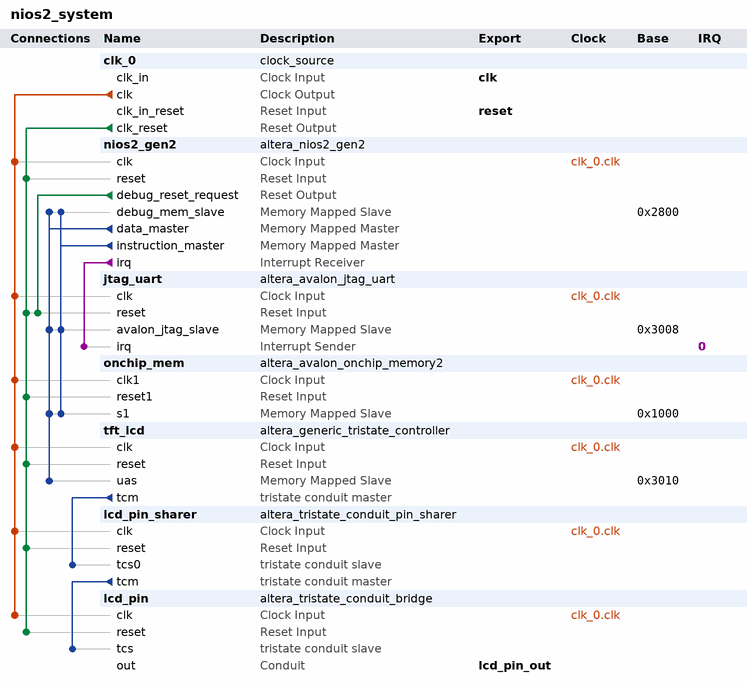
[diagram p0: system contents]
# Platform Designer (Qsys) system nios2_system, Cyclone V 5CSEBA6U23I7
# Parameters at their usual value, and those the tool derives, are not listed.
package require -exact qsys 18.1
create_system nios2_system
set_project_property DEVICE_FAMILY {Cyclone V}
set_project_property DEVICE 5CSEBA6U23I7

add_instance clk_0 clock_source 18.1
set_instance_parameter_value clk_0 clockFrequency 50000000

add_instance nios2_gen2 altera_nios2_gen2 18.1
set_instance_parameter_value nios2_gen2 dcache_size 2048
set_instance_parameter_value nios2_gen2 exceptionSlave onchip_mem.s1
set_instance_parameter_value nios2_gen2 icache_size 4096
set_instance_parameter_value nios2_gen2 impl Tiny
set_instance_parameter_value nios2_gen2 resetSlave onchip_mem.s1

add_instance jtag_uart altera_avalon_jtag_uart 18.1
set_instance_parameter_value jtag_uart simInteractiveOptions NO_INTERACTIVE_WINDOWS

add_instance onchip_mem altera_avalon_onchip_memory2 18.1
set_instance_parameter_value onchip_mem dataWidth 32
set_instance_parameter_value onchip_mem dualPort false
set_instance_parameter_value onchip_mem initMemContent true
set_instance_parameter_value onchip_mem initializationFileName onchip_mem.hex
set_instance_parameter_value onchip_mem memorySize 4096

add_instance tft_lcd altera_generic_tristate_controller 18.1
set_instance_parameter_value tft_lcd ACTIVE_LOW_BEGINTRANSFER 0
set_instance_parameter_value tft_lcd ACTIVE_LOW_BYTEENABLE 0
set_instance_parameter_value tft_lcd ACTIVE_LOW_OUTPUTENABLE 0
set_instance_parameter_value tft_lcd ACTIVE_LOW_READ 1
set_instance_parameter_value tft_lcd ACTIVE_LOW_RESET_OUTPUT 1
set_instance_parameter_value tft_lcd CHIPSELECT_THROUGH_READLATENCY 1
set_instance_parameter_value tft_lcd IS_MEMORY_DEVICE 0
set_instance_parameter_value tft_lcd TCM_ADDRESS_W 1
set_instance_parameter_value tft_lcd TCM_BYTEENABLE_W 1
set_instance_parameter_value tft_lcd TCM_DATA_HOLD 20
set_instance_parameter_value tft_lcd TCM_DATA_W 8
set_instance_parameter_value tft_lcd TCM_MAX_PENDING_READ_TRANSACTIONS 1
set_instance_parameter_value tft_lcd TCM_READLATENCY 2
set_instance_parameter_value tft_lcd TCM_READ_WAIT 80
set_instance_parameter_value tft_lcd TCM_SETUP_WAIT 0
set_instance_parameter_value tft_lcd TCM_SYMBOLS_PER_WORD 1
set_instance_parameter_value tft_lcd TCM_TIMING_UNITS 0
set_instance_parameter_value tft_lcd TCM_TURNAROUND_TIME 1
set_instance_parameter_value tft_lcd TCM_WRITE_WAIT 20
set_instance_parameter_value tft_lcd USE_BEGINTRANSFER 0
set_instance_parameter_value tft_lcd USE_BYTEENABLE 0
set_instance_parameter_value tft_lcd USE_OUTPUTENABLE 0
set_instance_parameter_value tft_lcd USE_READ 1
set_instance_parameter_value tft_lcd USE_RESET_OUTPUT 1

add_instance lcd_pin_sharer altera_tristate_conduit_pin_sharer 18.1
set_instance_parameter_value lcd_pin_sharer MODULE_ORIGIN_LIST tft_lcd.tcm,tft_lcd.tcm,tft_lcd.tcm,tft_lcd.tcm,tft_lcd.tcm,tft_lcd.tcm
set_instance_parameter_value lcd_pin_sharer NUM_INTERFACES 1
set_instance_parameter_value lcd_pin_sharer SHARED_SIGNAL_LIST LCD_RS,LCD_RD_n,LCD_REST_n,LCD_WR_n,LCD_DATA,LCD_CS_n
set_instance_parameter_value lcd_pin_sharer SIGNAL_ORIGIN_LIST address,read_n,reset_n,write_n,data,chipselect_n

add_instance lcd_pin altera_tristate_conduit_bridge 18.1

# connections
add_connection clk_0.clk jtag_uart.clk clock
add_connection clk_0.clk lcd_pin.clk clock
add_connection clk_0.clk lcd_pin_sharer.clk clock
add_connection clk_0.clk nios2_gen2.clk clock
add_connection clk_0.clk onchip_mem.clk1 clock
add_connection clk_0.clk tft_lcd.clk clock
add_connection clk_0.clk_reset jtag_uart.reset reset
add_connection clk_0.clk_reset lcd_pin.reset reset
add_connection clk_0.clk_reset lcd_pin_sharer.reset reset
add_connection clk_0.clk_reset nios2_gen2.reset reset
add_connection clk_0.clk_reset onchip_mem.reset1 reset
add_connection clk_0.clk_reset tft_lcd.reset reset
add_connection nios2_gen2.debug_reset_request jtag_uart.reset reset
add_connection nios2_gen2.data_master jtag_uart.avalon_jtag_slave avalon
set_connection_parameter_value nios2_gen2.data_master/jtag_uart.avalon_jtag_slave baseAddress 0x3008
add_connection nios2_gen2.data_master nios2_gen2.debug_mem_slave avalon
set_connection_parameter_value nios2_gen2.data_master/nios2_gen2.debug_mem_slave baseAddress 0x2800
add_connection nios2_gen2.data_master onchip_mem.s1 avalon
set_connection_parameter_value nios2_gen2.data_master/onchip_mem.s1 baseAddress 0x1000
add_connection nios2_gen2.data_master tft_lcd.uas avalon
set_connection_parameter_value nios2_gen2.data_master/tft_lcd.uas baseAddress 0x3010
add_connection nios2_gen2.instruction_master jtag_uart.avalon_jtag_slave avalon
set_connection_parameter_value nios2_gen2.instruction_master/jtag_uart.avalon_jtag_slave baseAddress 0x3008
add_connection nios2_gen2.instruction_master nios2_gen2.debug_mem_slave avalon
set_connection_parameter_value nios2_gen2.instruction_master/nios2_gen2.debug_mem_slave baseAddress 0x2800
add_connection nios2_gen2.instruction_master onchip_mem.s1 avalon
set_connection_parameter_value nios2_gen2.instruction_master/onchip_mem.s1 baseAddress 0x1000
add_connection nios2_gen2.irq jtag_uart.irq interrupt
set_connection_parameter_value nios2_gen2.irq/jtag_uart.irq irqNumber 0
add_connection lcd_pin_sharer.tcm lcd_pin.tcs tristate_conduit
add_connection tft_lcd.tcm lcd_pin_sharer.tcs0 tristate_conduit

# exported interfaces
add_interface clk clock sink
set_interface_property clk EXPORT_OF clk_0.clk_in
add_interface lcd_pin_out conduit end
set_interface_property lcd_pin_out EXPORT_OF lcd_pin.out
add_interface reset reset sink
set_interface_property reset EXPORT_OF clk_0.clk_in_reset

set_interconnect_requirement {$system} qsys_mm.clockCrossingAdapter HANDSHAKE
set_interconnect_requirement {$system} qsys_mm.enableEccProtection FALSE
set_interconnect_requirement {$system} qsys_mm.insertDefaultSlave FALSE
set_interconnect_requirement {$system} qsys_mm.maxAdditionalLatency 1

save_system nios2_system.qsys
